# EasyEDA Pro project BioWatch_PCB-DESKTOP-TT52GDR.eprj, schematic Schematic6
Create Date: 2023-01-23; Page Name: PCB_V6; Project Name: Watch_PCB; Schematic Name: Schematic6; Update Date: 2023-01-27; Company: EasyEDA.com; Drawed: EasyEDA Pro; Page Size: A4; Part Number: JLCPCB-002; Reviewed: EasyEDA Pro; Version: V0.1
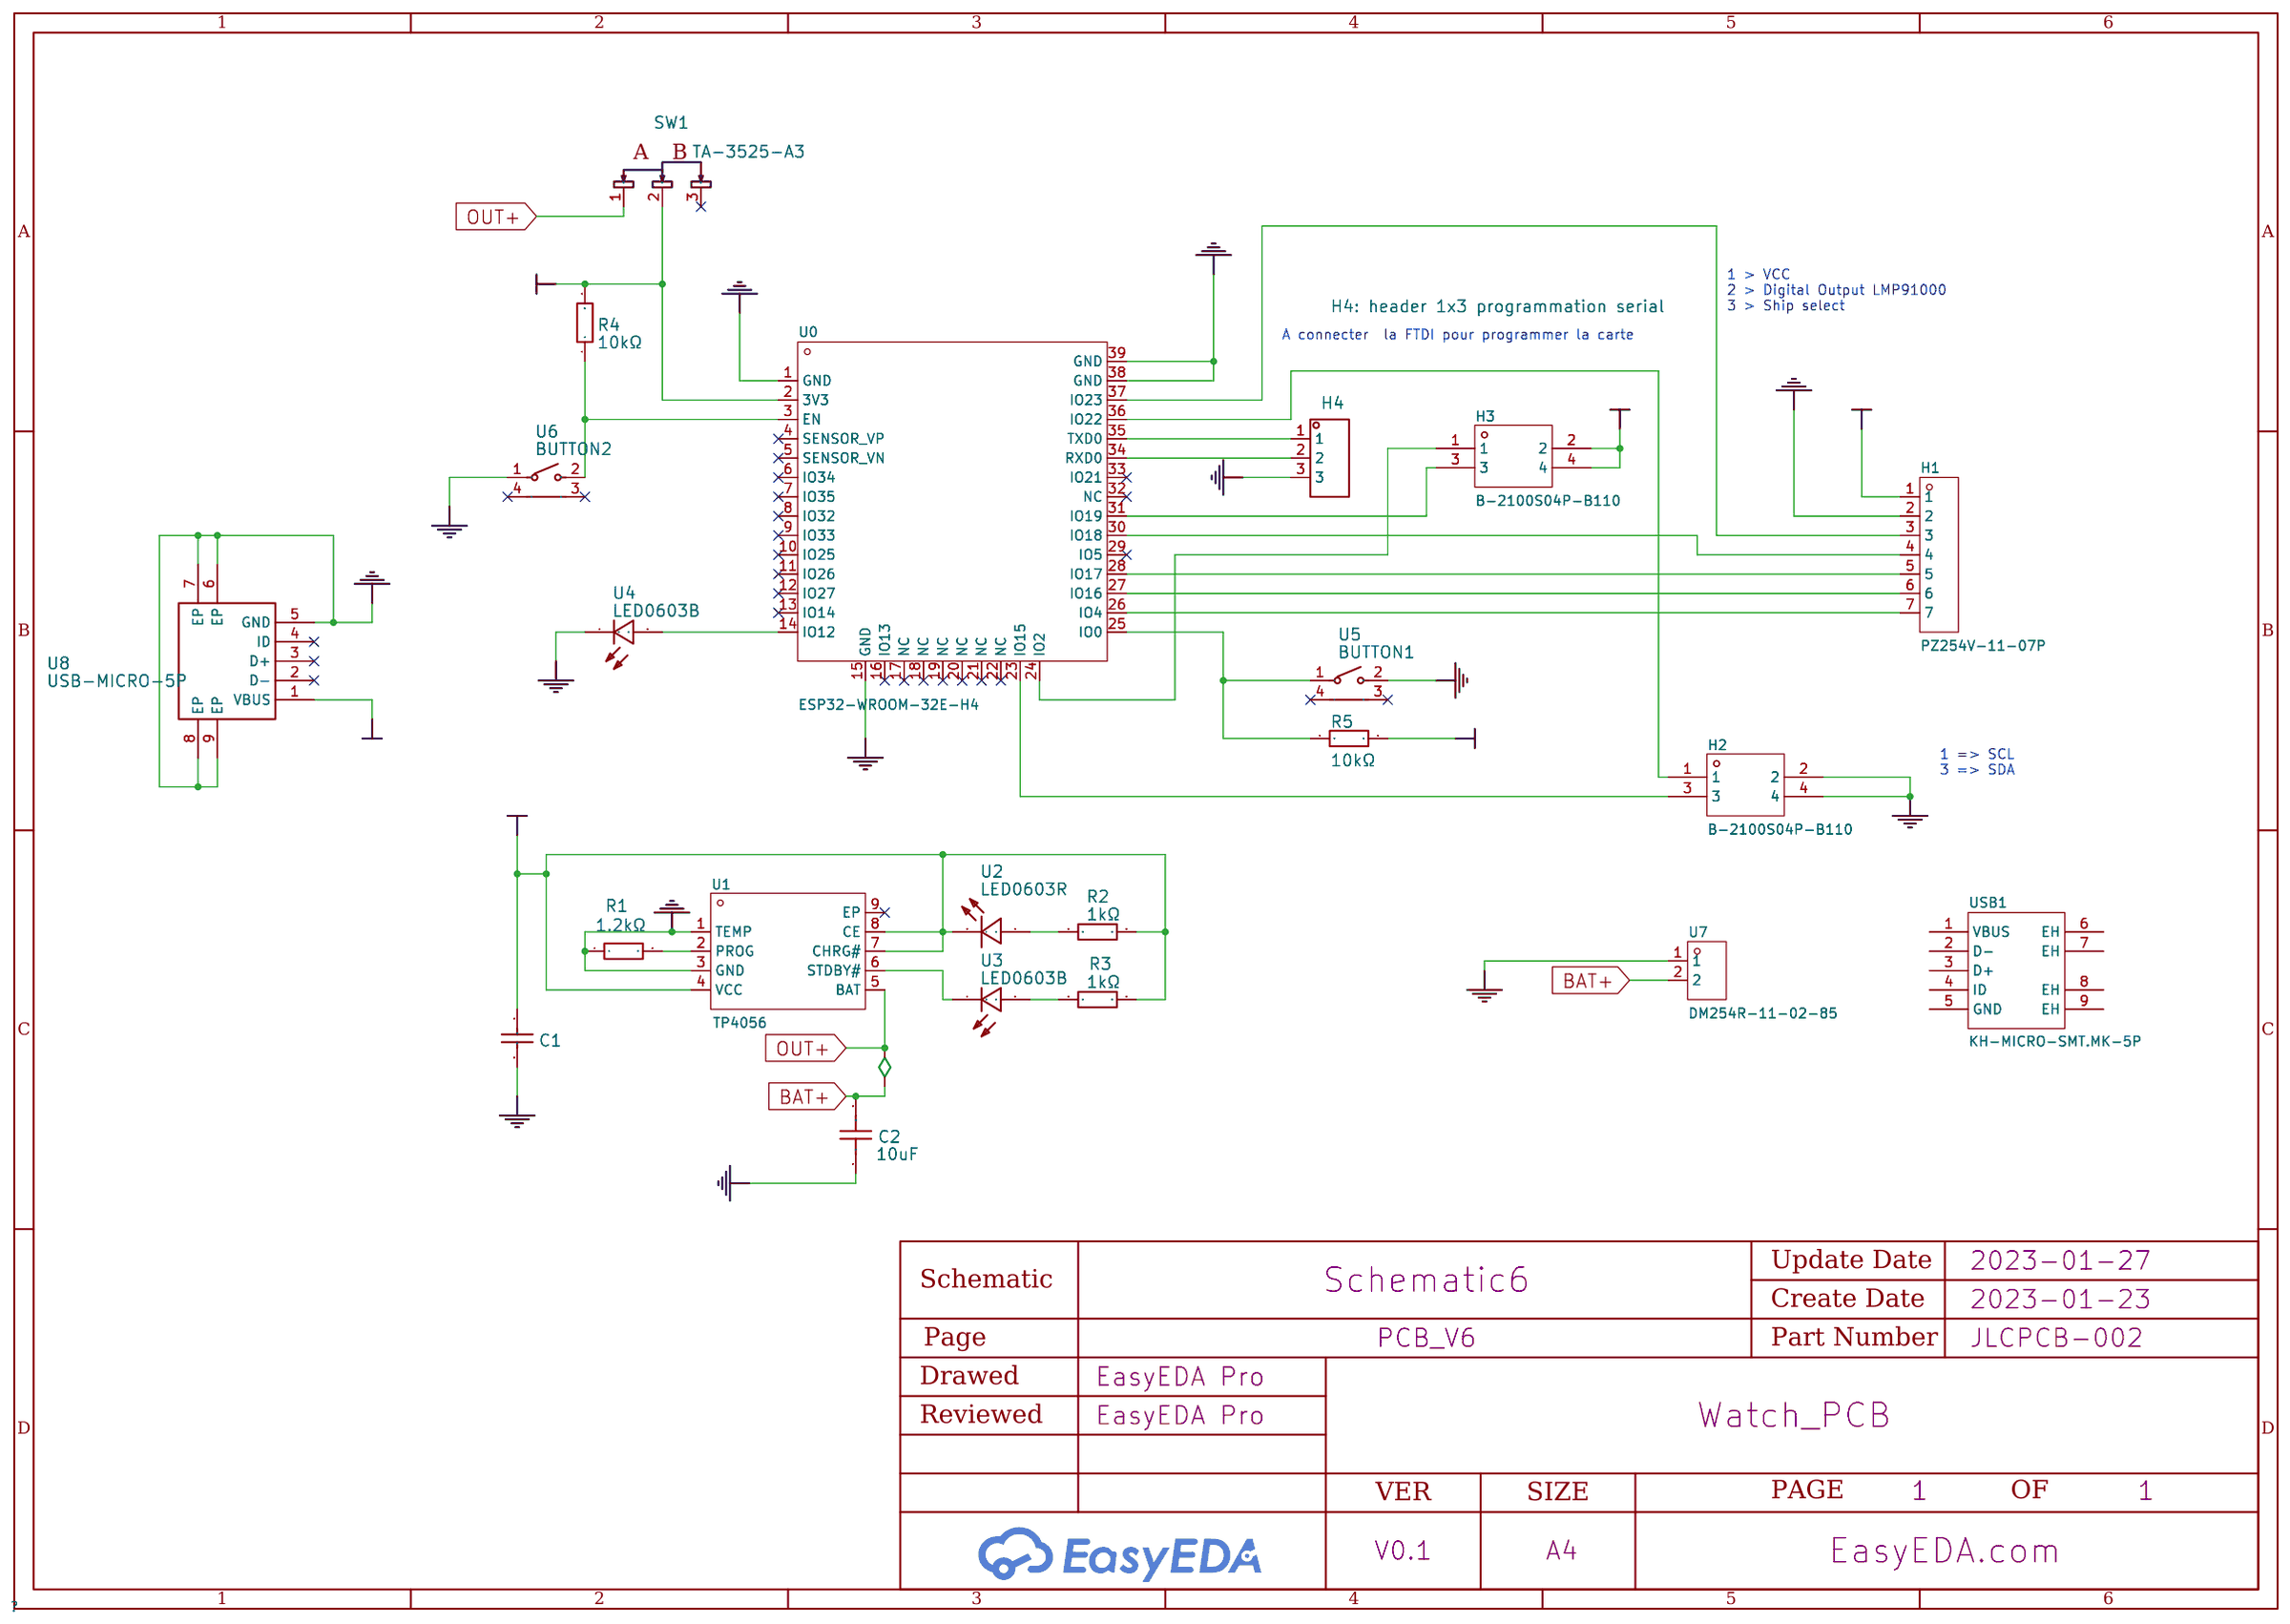
[diagram p6: schematic sheet]

## Parts
C1  CAPCER0.1UF16VX5R0603,CAPCER0.1UF25VX5R0603,CAPCER0.1UF16VX7R0603  [C0603]
C2  10uF  [C0603]
H1  PZ254V-11-07P  [HDR-TH_7P-P2.54-V-M]
H2  B-2100S04P-B110  [HDR-TH_4P-P2.54-V-M-R2-C2-S2.54-1]
H3  B-2100S04P-B110  [HDR-TH_4P-P2.54-V-M-R2-C2-S2.54-1]
H4  H4: header 1x3 programmation serial  [HEADER3L]
R1  1.2kΩ  [R0603]
R2  1kΩ  [R0603]
R3  1kΩ  [R0603]
R4  10kΩ  [R0603]
R5  10kΩ  [R0603]
SW1  TA-3525-A3  [SW-SMD_3P-L9.1-W3.5-P2.50-EH6.8]
U0  ESP32-WROOM-32E-H4  [WIFI-SMD_ESP32-WROOM-32E]
U1  TP4056  [ESOP-8_L4.9-W3.9-P1.27-LS6.0-BL-EP]
U2  LED0603R  [LED0603-R-RD]
U3  LED0603B  [LED0603-RD]
U4  LED0603B  [LED0603-RD]
U5  BUTTON1  [SW-SMD_L7.8-W3.5-P4.00-EH]
U6  BUTTON2  [SW-SMD_L7.8-W3.5-P4.00-EH]
U7  DM254R-11-02-85  [HDR-TH_2P-P2.54-V-F]
U8  USB-MICRO-5P  [MICRO-USB-SMD_MICRO-USB-A9]
USB1  KH-MICRO-SMT.MK-5P  [USB-C-SMD_MICRO5.9ZB5.0]

## Library data of the parts
C1 = CAPCER0.1UF16VX5R0603,CAPCER0.1UF25VX5R0603,CAPCER0.1UF16VX7R0603: link: https://item.szlcsc.com/362304.html; 3DModel: C0603_L1.6-W0.8-H0.8; Supplier: LCSC; Supplier Part: C9900012833; Manufacturer: null; JLCPCB Part Class: Extended Part
C2 = 10uF: link: https://item.szlcsc.com/362304.html; 3DModel: C0603_L1.6-W0.8-H0.8; Supplier: LCSC; Supplier Part: C15415; Manufacturer: SAMSUNG(三星); JLCPCB Part Class: Extended Part
H1 = PZ254V-11-07P: Number of Rows:单排 Number of Pins:7 Pitch:2.54mm Pin Structure:1x7P Row Spacing:- Mounting Type:Straight Circluar Pins/Square Pins:Square Pins Current Rating (Max):- Voltage Rating (Max):- Length of Mating Pin:6mm Insulation Height:2.5mm Length of End Conn; LCSC Part Name: 2.54mm 1x7P 直插 方针; Supplier Part: C492406; Manufacturer: XFCN(兴飞); Supplier Footprint: 直插,P=2.54mm; JLCPCB Part Class: Extended Part; Datasheet: https://atta.szlcsc.com/upload/public/pdf/source/20200309/C492406_654C533EE691117E22DD9F76C114C2D9.pdf; Supplier: LCSC; Number of Rows: 单排; Number of Pins: 7; Pitch: 2.54mm; Pin Structure: 1x7P; Mounting Type: Straight; Circluar Pins/Square Pins: Square Pins; Length of Mating Pin: 6mm; Insulation Height: 2.5mm; Length of End Connection Pin: 3mm; Operating Temperature Range: -40℃~+105℃; Color: Black
H2 H3 = B-2100S04P-B110: Number of Rows:双排 Number of Pins:4 Pitch:2.54mm Pin Structure:2x2P Row Spacing:2.54mm Mounting Type:Straight Circluar Pins/Square Pins:- Current Rating (Max):- Voltage Rating (Max):- Length of Mating Pin:6mm Insulation Height:2.54mm Length of End Connecti; LCSC Part Name: 2.54mm 2x2P 直插; Supplier Part: C124362; Manufacturer: Ckmtw(灿科盟); Supplier Footprint: 插件,P=2.54mm; JLCPCB Part Class: Extended Part; Datasheet: https://atta.szlcsc.com/upload/public/pdf/source/20170821/C124362_1503303299037901514.pdf; Supplier: LCSC; Number of Rows: 双排; Number of Pins: 4; Pitch: 2.54mm; Pin Structure: 2x2P; Row Spacing: 2.54mm; Mounting Type: Straight; Length of Mating Pin: 6mm; Insulation Height: 2.54mm; Length of End Connection Pin: 3mm; Operating Temperature Range: -40℃~+105℃; Color: Black
H4 = header 1x3: Supplier: LCSC; Manufacturer Part: Headers  Pins2.54mm1*10P; image: http://image.lceda.cn/szlcsc/C57369.jpg; Supplier Part: C57369
R1 = 1.2kΩ: 3DModel: R0603_L1.6-W0.8-H0.8; link: https://www.mouser.in/datasheet/2/447/PYu_RT_1_to_0_01_RoHS_L_11-1669912.pdf; Supplier: LCSC; Supplier Part: C269681; Manufacturer: Tyohm(幸亚电阻); Manufacturer Part: RMC06031.2K5%N; Resistance: 1.2K; JLCPCB Part Class: Extended Part
R2 R3 = 1kΩ: 3DModel: R0603_L1.6-W0.8-H0.8; link: https://www.mouser.in/datasheet/2/447/PYu_RT_1_to_0_01_RoHS_L_11-1669912.pdf; Supplier: LCSC; Manufacturer: UNI-ROYAL(厚声); Manufacturer Part: 0603WAD1001T5E; Supplier Part: C51218; Resistance: 1K; JLCPCB Part Class: Extended Part
R4 R5 = 10kΩ: 3DModel: R0603_L1.6-W0.8-H0.8; link: https://www.mouser.in/datasheet/2/447/PYu_RT_1_to_0_01_RoHS_L_11-1669912.pdf; Supplier: LCSC; Supplier Part: C346660; Manufacturer: SEI(Stackpole Electronics Inc.); Manufacturer Part: RNCS0603BKE10K0; Resistance: 10K; JLCPCB Part Class: Extended Part
SW1 = TA-3525-A3: link: https://item.szlcsc.com/529154.html?ref=editor&logined=true; Supplier: LCSC; Supplier Part: C514020; Manufacturer: Yuandi(元迪); JLCPCB Part Class: Extended Part
U0 = ESP32-WROOM-32E-H4: Supplier Part: C3013935; Manufacturer: ESPRESSIF(乐鑫); Supplier Footprint: SMD,18x25.5mm; JLCPCB Part Class: Extended Part; Datasheet: https://atta.szlcsc.com/upload/public/pdf/source/20220506/2B7DF1E5B41DABC7447F735C715CAF22.pdf; Supplier: LCSC
U1 = TP4056_C382139: LCSC Part Name: 1A锂电池充电IC; Supplier Part: C382139; Manufacturer: TPOWER(天源); Supplier Footprint: ESOP-8; JLCPCB Part Class: Extended Part; Datasheet: https://atta.szlcsc.com/upload/public/pdf/source/20190327/C382139_EC85960E6FE3E26856C240C81751A184.pdf; Supplier: LCSC
U2 = LED0603R: link: https://lcsc.com/product-detail/Light-Emitting-Diodes-LED_Hubei-KENTO-Elec-0603-Green_C12624.html; Supplier: LCSC; Supplier Part: C9900017730; Manufacturer: null; JLCPCB Part Class: Extended Part
U3 U4 = LED0603B: link: https://item.szlcsc.com/347874.html; Supplier: LCSC; Supplier Part: C9900005354; Manufacturer: null; JLCPCB Part Class: Extended Part
U5 U6 = BUTTONTACT_3X6X3.5: link: https://img.jlc.com/image//data/smt-stock-produce/componentSizePhoto/2021-12-22/ee97923d27ba48989625686833333d98/BG2112210604_D21122000046_font.png; Supplier: LCSC; Supplier Part: C9900004514; Manufacturer: null; Manufacturer Part: ButtonTACT_3x6x3.5; JLCPCB Part Class: Extended Part
U7 = DM254R-11-02-85: Number of Rows:单排 Number of Holes:2 Pitch:2.54mm Holes Structure:1x2P Row Spacing:- Mounting Type:Straight Circular Hole / Square Hole:Square Holes Current Rating (Max):3A Voltage Rating (Max):- Holes Direction:Top Insulation Height:8.5mm Operating Temper; LCSC Part Name: 2.54mm 1x2P 180度 Y型; Supplier Part: C2935973; Manufacturer: DEALON(德艺隆); Supplier Footprint: 插件,P=2.54mm; JLCPCB Part Class: Extended Part; Datasheet: https://atta.szlcsc.com/upload/public/pdf/source/20220110/4E97995FE1BF9788ECBB6F72A9540C3B.pdf; Supplier: LCSC; Number of Rows: 单排; Number of Holes: 2; Pitch: 2.54mm; Holes Structure: 1x2P; Mounting Type: Straight; Circular Hole / Square Hole: Square Holes; Current Rating (Max): 3A; Holes Direction: Top; Insulation Height: 8.5mm
U8 = USB-MICRO-5P: link: https://item.szlcsc.com/157113.html; Supplier: LCSC; Supplier Part: C9900014288; Manufacturer: null; Manufacturer Part: USB-Micro-5P; JLCPCB Part Class: Extended Part
USB1 = KH-MICRO-SMT.MK-5P: Connector Type:Micro-B Standard:USB 2.0 Gender:Female Number of Contacts:5 Number of Ports:1 Mounting Style:Surface Mount Current Rating - Power (Max):- Operating Temperature Range:-30℃~+85℃ Operating Temperature Range:-30℃~+85℃; LCSC Part Name: Micro-B 母座 卧贴; Supplier Part: C2688802; Manufacturer: kinghelm(金航标); Supplier Footprint: SMD; JLCPCB Part Class: Extended Part; Datasheet: https://atta.szlcsc.com/upload/public/pdf/source/20210202/C2688802_A866F9567E2F20AD2D3036B26830EC6A.pdf; Supplier: LCSC; Connector Type: Micro-B; Standard: USB 2.0; Gender: Female; Number of Contacts: 5; Number of Ports: 1; Mounting Style: Surface Mount; Operating Temperature Range: -30℃~+85℃

## Nets
+5V: C1.2 R2.2 R3.2 U1.4(VCC) U1.7(CHRG#) U1.8(CE) U2.2(-) U8.1(VBUS)
GND: C1.1 C2.1 H1.2 H2.2 H2.4 H4.3 R1.1 U0.1(GND) U0.15(GND) U0.38(GND) U0.39(GND) U1.1(TEMP) U1.3(GND) U4.1(K) U5.2 U6.1 U7.1 U8.5(GND) U8.6(EP) U8.7(EP) U8.8(EP) U8.9(EP)
VCC: H1.1 H3.2 H3.4 R4.2 R5.1 SW1.2 U0.2(3V3)
BAT+: C2.2 SW1.1 U1.5(BAT) U7.2
$2N3160: R1.2 U1.2(PROG)
$2N3161: R3.1 U3.2(A)
$2N3167: R2.1 U2.1(+)
$2N3169: U1.6(STDBY#) U3.1(K)
$2N3176: H1.5 U0.28(IO17)
$2N3180: H4.1 U0.35(TXD0)
$2N3181: H4.2 U0.34(RXD0)
$2N3182: H1.3 U0.37(IO23)
$2N3183: H1.6 U0.27(IO16)
$2N3191: R4.1 U0.3(EN) U6.2
$2N3194: R5.2 U0.25(IO0) U5.1
$2N4014: H1.4 U0.30(IO18)
$2N4020: H2.3 U0.23(IO15)
$2N4222: H3.3 U0.31(IO19)
$2N4223: H1.7 U0.26(IO4)
$2N4430: H2.1 U0.36(IO22)
$2N6627: U0.14(IO12) U4.2(A)
$2N15231: H3.1 U0.24(IO2)

Not connected (* = marked no-connect by the designer): SW1 3*; U0 4(SENSOR_VP)* 5(SENSOR_VN)* 6(IO34)* 7(IO35)* 8(IO32)* 9(IO33)* 10(IO25)* 11(IO26)* 12(IO27)* 13(IO14)* 16(IO13)* 17(NC)* 18(NC)* 19(NC)* 20(NC)* 21(NC)* 22(NC)* 29(IO5)* 32(NC)* 33(IO21)*; U1 9(EP)*; U5 3* 4*; U6 3* 4*; U8 2(D-)* 3(D+)* 4(ID)*; USB1 1(VBUS) 2(D-) 3(D+) 4(ID) 5(GND) 6(EH) 7(EH) 8(EH) 9(EH)

## Notes on the sheet
- 1 > VCC
  2 > Digital Output LMP91000
  3 > Ship select
- A connecter  la FTDI pour programmer la carte
- 1 => SCL
  3 => SDA
